# Altium schematic sheet Analog_schematic.SchDoc
size A
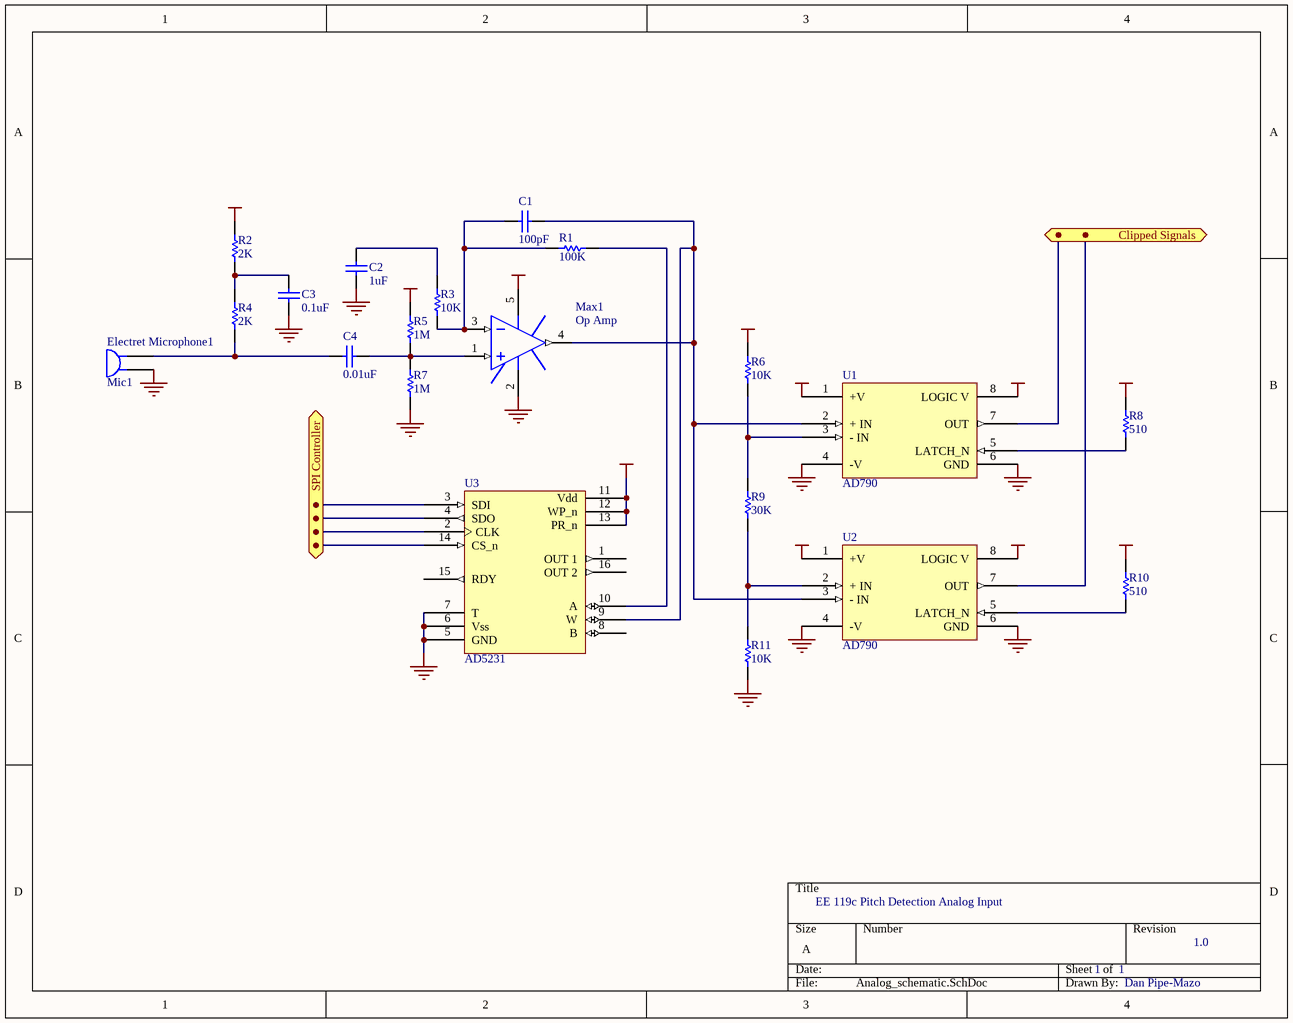
[diagram p0: Analog_schematic.SchDoc]

## Parts
C1  100pF  [RAD-0.3]
C2  1uF  [RAD-0.3]
C3  0.1uF  [RAD-0.3]
C4  0.01uF  [RAD-0.3]
Electret_Microphone1  Mic1  [PIN2]
Max1  Op Amp  [CAN-8/D9.4]
R1  100K  [AXIAL-0.3]
R2  2K  [AXIAL-0.3]
R3  10K  [AXIAL-0.3]
R4  2K  [AXIAL-0.3]
R5  1M  [AXIAL-0.3]
R6  10K  [AXIAL-0.3]
R7  1M  [AXIAL-0.3]
R8  510  [AXIAL-0.3]
R9  30K  [AXIAL-0.3]
R10  510  [AXIAL-0.3]
R11  10K  [AXIAL-0.3]
U1  AD790
U2  AD790
U3  AD5231

## Ports
Clipped Signals (out), SPI Controller

## Nets
+3.3 V: U1.8(LOGIC_V) U2.8(LOGIC_V)
+5V: Max1.5(V+) R2.2 R5.2 R6.2 R8.2 R10.2 U1.1(+V) U2.1(+V) U3.11(Vdd) U3.12(WP_n) U3.13(PR_n)
GND: C2.1 C3.1 Electret_Microphone1.1 Max1.2(V-) R7.1 R11.1 U1.4(-V) U1.6(GND) U2.4(-V) U2.6(GND) U3.5(GND) U3.6(Vss) U3.7(T)
NetC1_1: C1.1 Max1.4(OUT) U1.2(+_IN) U2.3(-_IN) U3.9(W)
NetC1_2: C1.2 Max1.3(IN-) R1.2 R3.1
NetC2_2: C2.2 R3.2
NetC3_2: C3.2 R2.1 R4.2
NetC4_1: C4.1 Max1.1(IN+) R5.1 R7.2
NetC4_2: C4.2 Electret_Microphone1.2 R4.1
NetR1_1: R1.1 U3.10(A)
NetR6_1: R6.1 R9.2 U1.3(-_IN)
NetR8_1: R8.1 U1.5(LATCH_N)
NetR9_1: R9.1 R11.2 U2.2(+_IN)
NetR10_1: R10.1 U2.5(LATCH_N)

Not connected (* = marked no-connect by the designer): U1 7(OUT); U2 7(OUT); U3 1(OUT_1) 2(CLK) 3(SDI) 4(SDO) 8(B) 14(CS_n) 15(RDY) 16(OUT_2)

## Notes on the sheet
- EE 119c Pitch Detection Analog Input
- 1
- 1.0
- Dan Pipe-Mazo

## Library data of the parts
C1 = Cap: Capacitor; Published: 8-Jun-2000; Revision: July-2002: Re-released for DXP Platform.; Publisher: Altium Limited; Value: 100pF
C2-C4 = Cap: Capacitor; Value: 100pF; Published: 8-Jun-2000; Revision: July-2002: Re-released for DXP Platform.; Publisher: Altium Limited
Electret_Microphone1 = Mic1: Microphone; Published: 24-Mar-1999; Revision: July-2002: Re-released for DXP Platform.; Publisher: Altium Limited
Max1 = Op Amp: FET Operational Amplifier; Published: 8-Jun-2000; Revision: July-2002: Re-released for DXP Platform.; Datasheet: Latest Revision: REV. B; Package Reference: H-08A; Publisher: Altium Limited
R1-R3 R5 R8 R10 = Res1: Resistor; Value: 1K; Published: 8-Jun-2000; Revision: July-2002: Re-released for DXP Platform.; Publisher: Altium Limited
R4 R6 R7 R9 R11 = Res1: Resistor; Published: 8-Jun-2000; Revision: July-2002: Re-released for DXP Platform.; Publisher: Altium Limited